# EAGLE schematic PCB board (EAGLE 7.5.0)
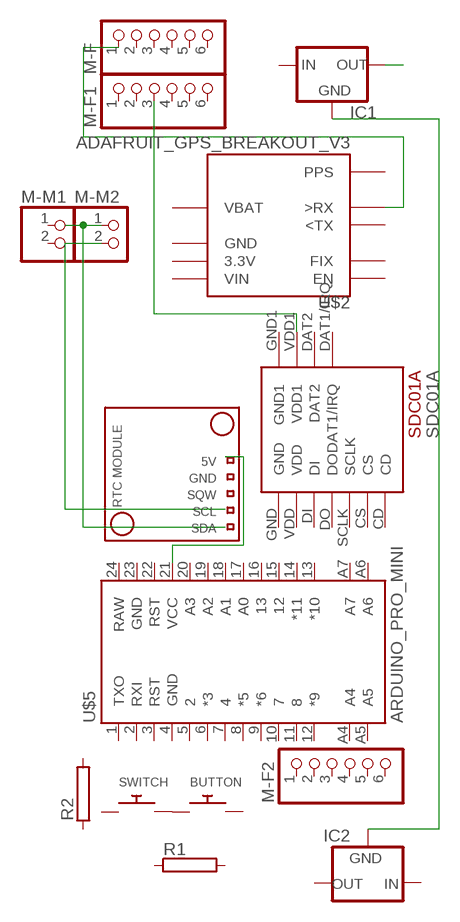
[diagram p0: schematic, sheet 1]

## Parts
BUTTON  SWITCH_PUSHBUTTONSOFTTOUCHSMD_SJ  [PUSHBUTTON_SMD_SJ]
IC1  78XX/TO3  [TO3/78]
IC2  78XX/TO3  [TO3/78]
M-F  PINHD-1X6  [1X06]
M-F1  PINHD-1X6  [1X06]
M-F2  PINHD-1X6  [1X06]
M-M1  PINHD-1X2  [1X02]
M-M2  PINHD-1X2  [1X02]
R1  RMG100-V  [TO-247-2V]
R2  RMG100-V  [TO-247-2V]
SWITCH  SWITCH_PUSHBUTTONEVQ-PE  [TACT_PANA-EVQ]
U$1  REAL_TIME_CLOCK  [REAL_TIME_CLOCK]
U$2  ADAFRUIT_GPS_BREAKOUT_V3  [ADAFRUIT_GPS_BREAKOUT_V3]
U$3  SDC01A  [SDC01A]
U$5  ARDUINO_PRO_MINI  [ARDUINO_PRO_MINI]

## Nets
N$1: BUTTON.P$1 SWITCH.P$2
N$2: M-M2.2
N$3: M-F1.3 U$3.VDD1
N$4: IC1.1(OUT)
N$5: U$5.21(VCC)
N$6: IC1.3(GND) IC2.3(GND)
N$7: M-M2.1
N$8: M-F.1 U$2.RX(>RX)
Unconnected: BUTTON.P$2 IC1.2(IN) IC2.1(OUT) IC2.2(IN) M-F1.1 M-F1.2 M-F1.4 M-F1.5 M-F1.6 M-F2.1 M-F2.2 M-F2.3 M-F2.4 M-F2.5 M-F2.6 M-F.2 M-F.3 M-F.4 M-F.5 M-F.6 M-M1.1 M-M1.2 R1.1 R1.2 R2.1 R2.2 SWITCH.P$1 U$2.EN U$2.FIX U$2.PPS U$2.TX(<TX) U$3.CD U$3.CS U$3.DAT1/IRQ U$3.DAT2 U$3.DI U$3.DO U$3.GND U$3.GND1 U$3.SCLK U$3.VDD U$5.1(TXO) U$5.2(RXI) U$5.3(RST) U$5.4(GND) U$5.5 U$5.6(*3) U$5.7 U$5.8(*5) U$5.9(*6) U$5.10 U$5.11 U$5.12(*9) U$5.13(*10) U$5.14(*11) U$5.15 U$5.16 U$5.17(A0) U$5.18(A1) U$5.19(A2) U$5.20(A3) U$5.22(RST) U$5.23(GND) U$5.24(RAW) U$5.A4 U$5.A5 U$5.A6 U$5.A7

## Power pins joined to a net without a drawn wire
3.3V: U$2.3.3V
GND: U$2.GND
VBAT: U$2.VBAT
VIN: U$2.VIN

## Library data of the parts
BUTTON SWITCH = adafruit:SWITCH_PUSHBUTTON: Buttons SOFTTOUCHSMD_SJ - Soft touch temporary push button (Super Junk Akihabara) Compatible with SKPMANE010 [Mouser: 688-SKPMAN] C&K_KSS = Digikey: KSS221GLFS
IC1 IC2 = v-reg:78XX/TO3: VOLTAGE REGULATOR
M-F M-F1 M-F2 = pinhead:PINHD-1X6: PIN HEADER
M-M1 M-M2 = pinhead:PINHD-1X2: PIN HEADER
R1 R2 = resistor-power:RMG100: TO-247 Power Resistor - RMG 100 Series Source: www.token.com.tw .. power-resistor-rmg100pdf; OC_FARNELL: unknown; OC_NEWARK: unknown
U$1 = CANSat:REAL_TIME_CLOCK
U$2 = CANSat:ADAFRUIT_GPS_BREAKOUT_V3
U$3 = SDC01A:SDC01A
U$5 = CANSat:ARDUINO_PRO_MINI